# Altium schematic sheet Main.SchDoc
size A; DocumentNumber: 1; SheetNumber: 1; SheetTotal: 5
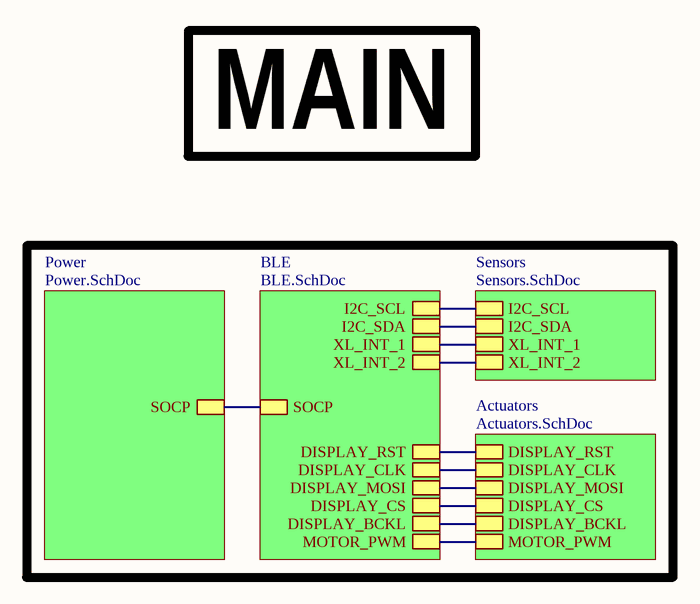
[diagram p0: Main.SchDoc]

## Sub-sheets
Actuators = Actuators.SchDoc: DISPLAY_RST, DISPLAY_CLK, DISPLAY_MOSI, DISPLAY_CS, DISPLAY_BCKL, MOTOR_PWM
BLE = BLE.SchDoc: SOCP, DISPLAY_RST, DISPLAY_CLK, DISPLAY_MOSI, DISPLAY_CS, DISPLAY_BCKL, MOTOR_PWM, I2C_SCL, I2C_SDA, XL_INT_1, XL_INT_2
Power = Power.SchDoc: SOCP
Sensors = Sensors.SchDoc: I2C_SCL, I2C_SDA, XL_INT_1, XL_INT_2

## Nets
(unnamed): sheet Power/SOCP, sheet BLE/SOCP
(unnamed): sheet Actuators/DISPLAY_RST, sheet BLE/DISPLAY_RST
(unnamed): sheet Actuators/DISPLAY_CLK, sheet BLE/DISPLAY_CLK
(unnamed): sheet Actuators/DISPLAY_MOSI, sheet BLE/DISPLAY_MOSI
(unnamed): sheet Actuators/DISPLAY_CS, sheet BLE/DISPLAY_CS
(unnamed): sheet Actuators/DISPLAY_BCKL, sheet BLE/DISPLAY_BCKL
(unnamed): sheet Actuators/MOTOR_PWM, sheet BLE/MOTOR_PWM
(unnamed): sheet BLE/I2C_SCL, sheet Sensors/I2C_SCL
(unnamed): sheet BLE/I2C_SDA, sheet Sensors/I2C_SDA
(unnamed): sheet BLE/XL_INT_1, sheet Sensors/XL_INT_1
(unnamed): sheet BLE/XL_INT_2, sheet Sensors/XL_INT_2

## Notes on the sheet
- MAIN